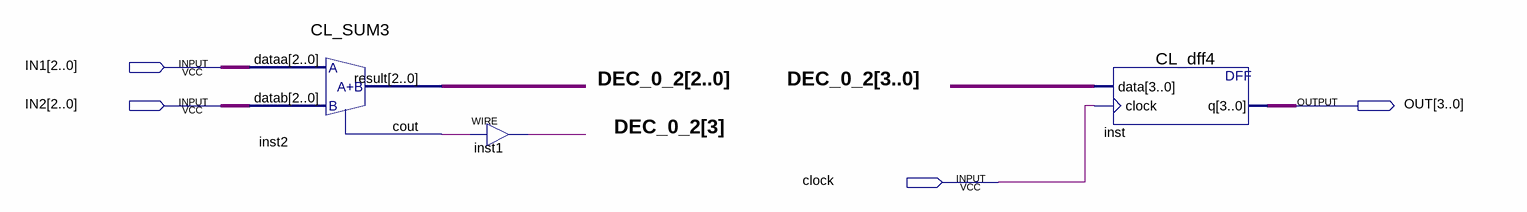
[diagram p0: schematic sheet]
// Quartus schematic CL_SUM3_BL.bdf as structural Verilog: 3 symbols, 4 pins
module CL_SUM3_BL (
  input  [2:0] IN1,
  input  [2:0] IN2,
  input  clock,
  output [3:0] OUT
);

  wire inst2_cout;
  wire [3:0] DEC_0_2;

  CL_SUM3 inst2 (.dataa(IN1), .datab(IN2), .result(DEC_0_2[2:0]), .cout(inst2_cout));
  assign DEC_0_2[3] = inst2_cout;  // WIRE inst1
  CL_dff4 inst (.data(DEC_0_2), .clock(clock), .q(OUT));
endmodule
